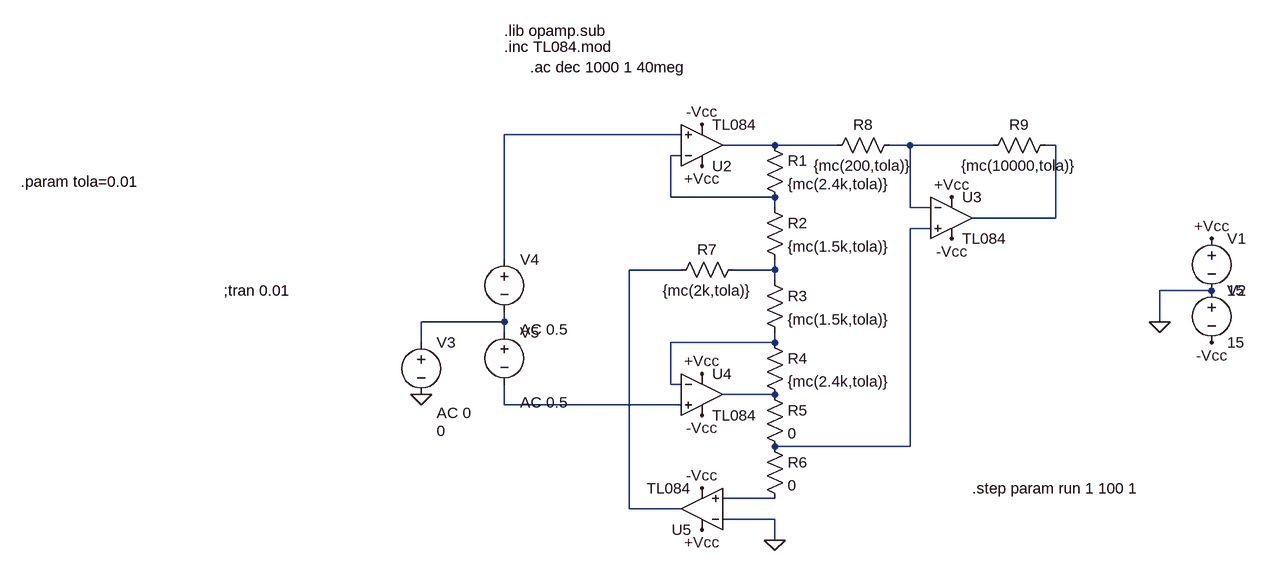
[diagram p0: schematic montecarlo_diferencial.asc]
montecarlo_diferencial.asc, the LTspice schematic file:
Version 4
SHEET 1 1296 840
WIRE -32 128 -304 128
WIRE 112 144 32 144
WIRE 208 144 112 144
WIRE 320 144 288 144
WIRE 448 144 320 144
WIRE 544 144 528 144
WIRE -32 160 -48 160
WIRE -48 224 -48 160
WIRE 112 224 -48 224
WIRE 112 240 112 224
WIRE 320 240 320 144
WIRE 352 240 320 240
WIRE 544 256 544 144
WIRE 544 256 416 256
WIRE 352 272 320 272
WIRE -304 320 -304 128
WIRE -32 336 -112 336
WIRE 112 336 112 320
WIRE 112 336 48 336
WIRE 112 352 112 336
WIRE 784 368 704 368
WIRE -304 416 -304 400
WIRE -304 416 -432 416
WIRE 704 416 704 368
WIRE -304 432 -304 416
WIRE -432 448 -432 416
WIRE 80 448 -48 448
WIRE 112 448 112 432
WIRE 112 448 80 448
WIRE -48 512 -48 448
WIRE -32 512 -48 512
WIRE 112 528 32 528
WIRE -304 544 -304 512
WIRE -32 544 -304 544
WIRE 320 608 320 272
WIRE 320 608 112 608
WIRE 112 688 32 688
WIRE -112 704 -112 336
WIRE -32 704 -112 704
WIRE 112 720 32 720
WIRE 112 752 112 720
FLAG 112 752 0
FLAG 704 416 0
FLAG 784 288 +Vcc
FLAG 384 224 +Vcc
FLAG 0 496 +Vcc
FLAG 0 736 +Vcc
FLAG 0 176 +Vcc
FLAG 784 448 -Vcc
FLAG 384 288 -Vcc
FLAG 0 112 -Vcc
FLAG 0 560 -Vcc
FLAG 0 672 -Vcc
FLAG -432 528 0
DATAFLAG 528 144 ""
DATAFLAG 80 448 ""
SYMBOL res 96 128 R0
SYMATTR InstName R1
SYMATTR Value {mc(2.4k,tola)}
SYMBOL res 96 224 R0
SYMATTR InstName R2
SYMATTR Value {mc(1.5k,tola)}
SYMBOL res 96 336 R0
SYMATTR InstName R3
SYMATTR Value {mc(1.5k,tola)}
SYMBOL res 96 432 R0
SYMATTR InstName R4
SYMATTR Value {mc(2.4k,tola)}
SYMBOL res 96 512 R0
SYMATTR InstName R5
SYMATTR Value 0
SYMBOL res 96 592 R0
SYMATTR InstName R6
SYMATTR Value 0
SYMBOL res 64 320 R90
WINDOW 0 0 56 VBottom 2
WINDOW 3 32 56 VTop 2
SYMATTR InstName R7
SYMATTR Value {mc(2k,tola)}
SYMBOL res 304 128 R90
WINDOW 0 0 56 VBottom 2
WINDOW 3 32 56 VTop 2
SYMATTR InstName R8
SYMATTR Value {mc(200,tola)}
SYMBOL res 544 128 R90
WINDOW 0 0 56 VBottom 2
WINDOW 3 32 56 VTop 2
SYMATTR InstName R9
SYMATTR Value {mc(10000,tola)}
SYMBOL voltage 784 272 R0
WINDOW 123 0 0 Left 2
WINDOW 39 0 0 Left 2
SYMATTR InstName V1
SYMATTR Value 15
SYMBOL voltage 784 352 R0
WINDOW 123 0 0 Left 2
WINDOW 39 0 0 Left 2
SYMATTR InstName V2
SYMATTR Value 15
SYMBOL voltage -432 432 R0
WINDOW 3 24 152 Left 2
WINDOW 123 24 124 Left 2
WINDOW 39 0 0 Left 2
SYMATTR Value 0
SYMATTR Value2 AC 0
SYMATTR InstName V3
SYMBOL voltage -304 304 R0
WINDOW 123 24 124 Left 2
WINDOW 39 0 0 Left 2
SYMATTR Value2 AC 0.5
SYMATTR InstName V4
SYMATTR Value ""
SYMBOL voltage -304 416 R0
WINDOW 123 24 124 Left 2
WINDOW 39 0 0 Left 2
SYMATTR Value2 AC 0.5
SYMATTR InstName V5
SYMATTR Value ""
SYMBOL Opamps\\opamp2 0 208 M180
SYMATTR InstName U2
SYMATTR Value TL084
SYMATTR SpiceModel TL084
SYMBOL Opamps\\opamp2 384 192 R0
SYMATTR InstName U3
SYMATTR Value TL084
SYMATTR SpiceModel TL084
SYMBOL Opamps\\opamp2 0 464 R0
SYMATTR InstName U4
SYMATTR Value TL084
SYMATTR SpiceModel TL084
SYMBOL Opamps\\opamp2 0 768 R180
SYMATTR InstName U5
SYMATTR Value TL084
SYMATTR SpiceModel TL084
TEXT -304 -8 Left 2 !.inc TL084.mod
TEXT -304 -32 Left 2 !.lib opamp.sub
TEXT -264 24 Left 2 !.ac dec 1000 1 40meg
TEXT -736 368 Left 2 !;tran 0.01
TEXT -1048 200 Left 2 !.param tola=0.01
TEXT 416 672 Left 2 !.step param run 1 100 1

The netlist it stands for:
* montecarlo_diferencial.asc
R1 N002 N005 {mc(2.4k,tola)}
R2 N005 N008 {mc(1.5k,tola)}
R3 N008 N010 {mc(1.5k,tola)}
R4 N010 N011 {mc(2.4k,tola)}
R5 N011 N006 0
R6 N006 N013 0
R7 N008 N007 {mc(2k,tola)}
R8 N003 N002 {mc(200,tola)}
R9 N004 N003 {mc(10000,tola)}
V1 +Vcc 0 15
V2 0 -Vcc 15
V3 N009 0 0 AC 0
V4 N001 N009 AC 0.5
V5 N009 N012 AC 0.5
XU2 N001 N005 +Vcc -Vcc N002 TL084 TL084  ; pins In+ In- V+ V- OUT
XU3 N006 N003 +Vcc -Vcc N004 TL084 TL084  ; pins In+ In- V+ V- OUT
XU4 N012 N010 +Vcc -Vcc N011 TL084 TL084  ; pins In+ In- V+ V- OUT
XU5 N013 0 +Vcc -Vcc N007 TL084 TL084  ; pins In+ In- V+ V- OUT
.inc TL084.mod
.lib opamp.sub
.ac dec 1000 1 40meg
;tran 0.01
.param tola=0.01
.step param run 1 100 1
.backanno
.end